# EAGLE design 1608_lora_communicator (EAGLE 9.6.2)
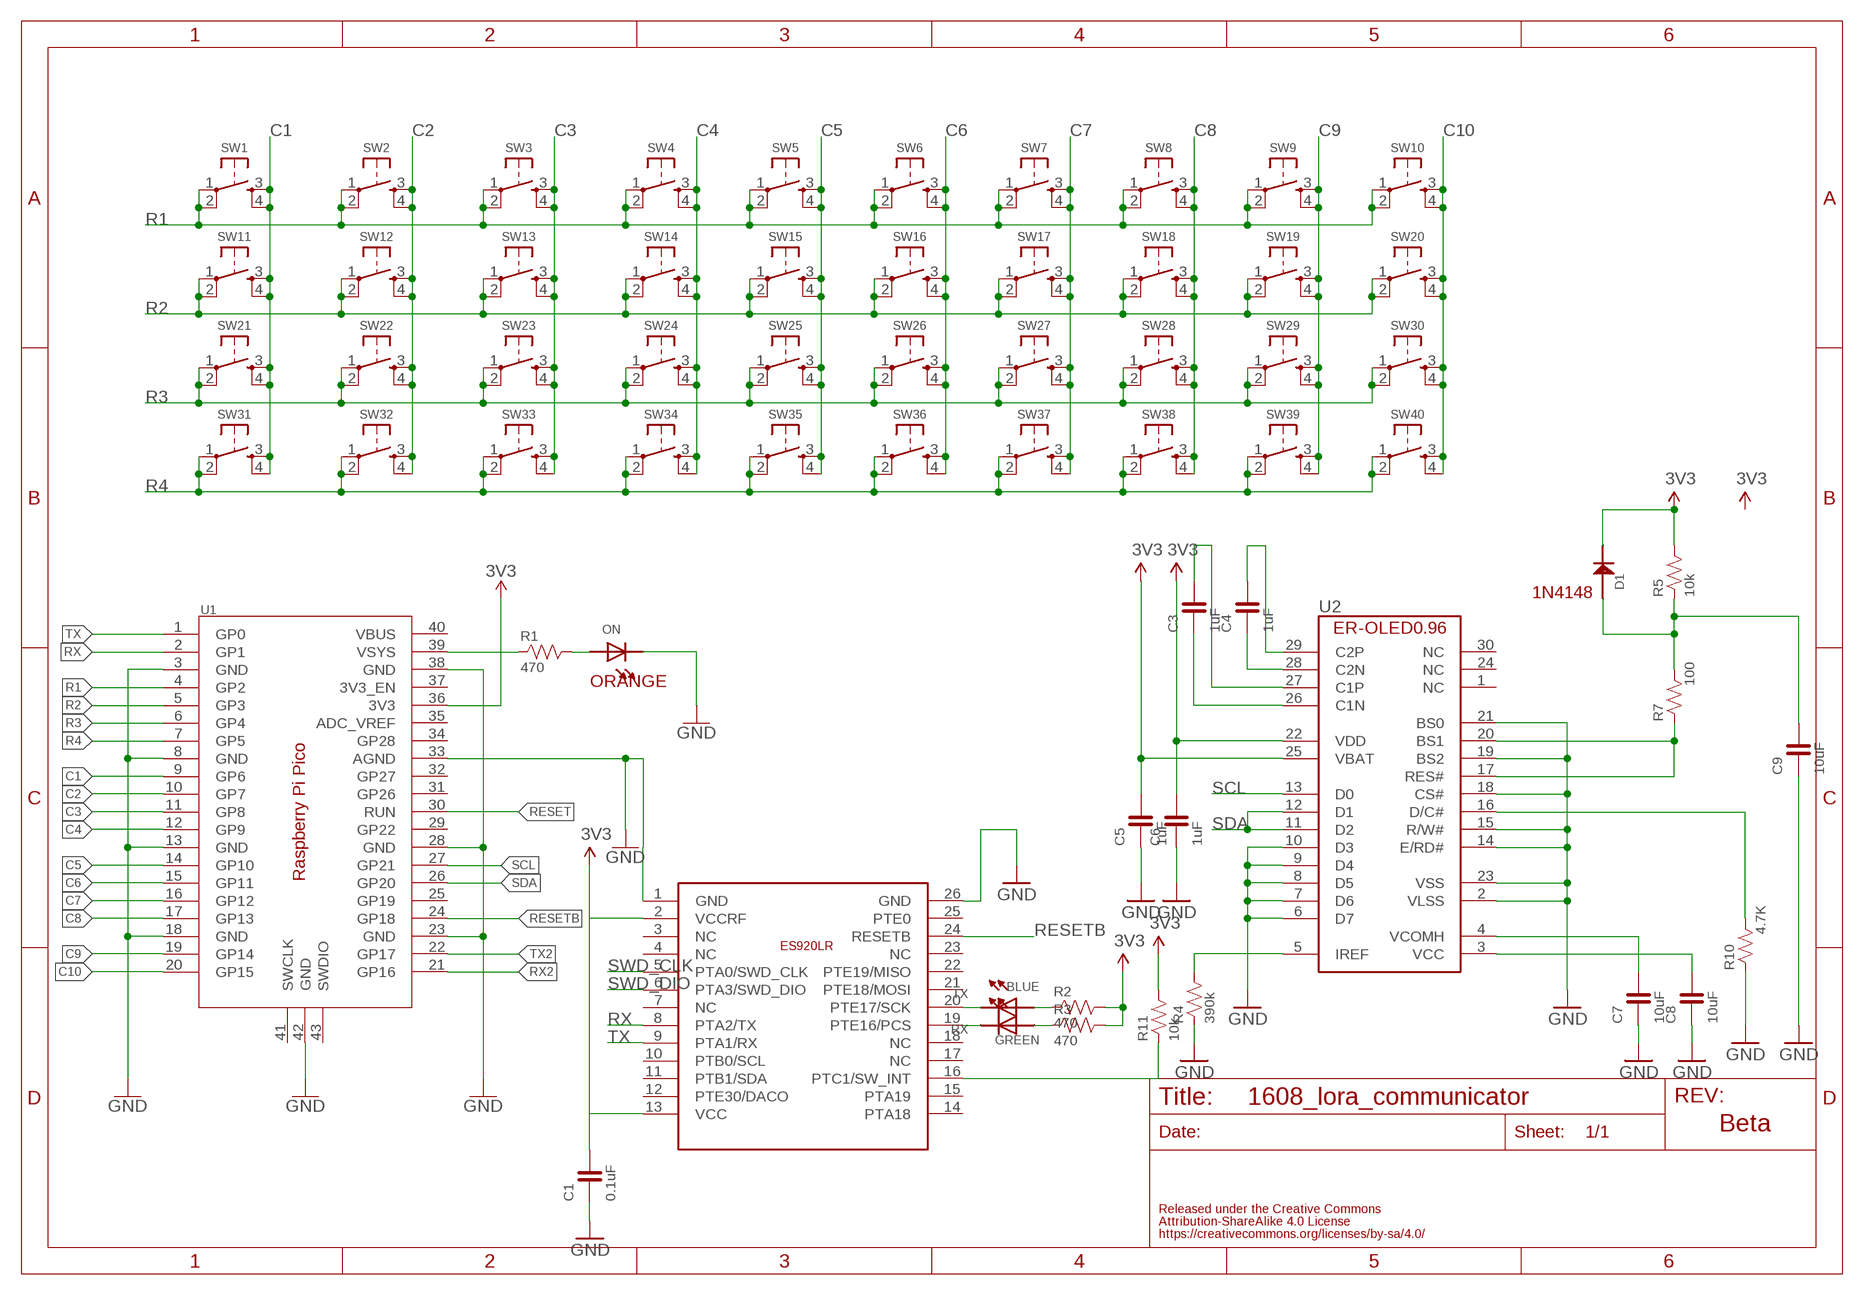
[diagram p0: schematic, sheet 1]

## Parts
C1  0.1uF  CAPACITOR-0603_NARROW  [0603-NARROW]
C3  1uF  CAPACITOR-0603  [0603]
C4  1uF  CAPACITOR-0603  [0603]
C5  1uF  CAPACITOR-0603  [0603]
C6  1uF  CAPACITOR-0603  [0603]
C7  10uF  CAPACITOR-0603  [0603]
C8  10uF  CAPACITOR-0603  [0603]
C9  10uF  CAPACITOR-0603  [0603]
D1  1N4148  [1N4148W]
ON  LED-0603  [0603]
R1  470  RESISTOR-0603  [0603]
R2  470  RESISTOR-0603  [0603]
R3  470  RESISTOR-0603  [0603]
R4  390k  RESISTOR-0603  [0603]
R5  10k  RESISTOR-0603  [0603]
R7  100  RESISTOR-0603  [0603]
R10  4.7K  RESISTOR-0603  [0603]
R11  10k  RESISTOR-0603-NARROW  [0603-NARROW]
RX  GREEN  LED-0603  [0603]
SW1  TACT-SWITCH-6MM  [DTS_6_V]
SW2  TACT-SWITCH-6MM  [DTS_6_V]
SW3  TACT-SWITCH-6MM  [DTS_6_V]
SW4  TACT-SWITCH-6MM  [DTS_6_V]
SW5  TACT-SWITCH-6MM  [DTS_6_V]
SW6  TACT-SWITCH-6MM  [DTS_6_V]
SW7  TACT-SWITCH-6MM  [DTS_6_V]
SW8  TACT-SWITCH-6MM  [DTS_6_V]
SW9  TACT-SWITCH-6MM  [DTS_6_V]
SW10  TACT-SWITCH-6MM  [DTS_6_V]
SW11  TACT-SWITCH-6MM  [DTS_6_V]
SW12  TACT-SWITCH-6MM  [DTS_6_V]
SW13  TACT-SWITCH-6MM  [DTS_6_V]
SW14  TACT-SWITCH-6MM  [DTS_6_V]
SW15  TACT-SWITCH-6MM  [DTS_6_V]
SW16  TACT-SWITCH-6MM  [DTS_6_V]
SW17  TACT-SWITCH-6MM  [DTS_6_V]
SW18  TACT-SWITCH-6MM  [DTS_6_V]
SW19  TACT-SWITCH-6MM  [DTS_6_V]
SW20  TACT-SWITCH-6MM  [DTS_6_V]
SW21  TACT-SWITCH-6MM  [DTS_6_V]
SW22  TACT-SWITCH-6MM  [DTS_6_V]
SW23  TACT-SWITCH-6MM  [DTS_6_V]
SW24  TACT-SWITCH-6MM  [DTS_6_V]
SW25  TACT-SWITCH-6MM  [DTS_6_V]
SW26  TACT-SWITCH-6MM  [DTS_6_V]
SW27  TACT-SWITCH-6MM  [DTS_6_V]
SW28  TACT-SWITCH-6MM  [DTS_6_V]
SW29  TACT-SWITCH-6MM  [DTS_6_V]
SW30  TACT-SWITCH-6MM  [DTS_6_V]
SW31  TACT-SWITCH-6MM  [DTS_6_V]
SW32  TACT-SWITCH-6MM  [DTS_6_V]
SW33  TACT-SWITCH-6MM  [DTS_6_V]
SW34  TACT-SWITCH-6MM  [DTS_6_V]
SW35  TACT-SWITCH-6MM  [DTS_6_V]
SW36  TACT-SWITCH-6MM  [DTS_6_V]
SW37  TACT-SWITCH-6MM  [DTS_6_V]
SW38  TACT-SWITCH-6MM  [DTS_6_V]
SW39  TACT-SWITCH-6MM  [DTS_6_V]
SW40  TACT-SWITCH-6MM  [DTS_6_V]
TX  BLUE  LED-0603  [0603]
U1  RASPBERRY_PI_PICORASPBERRY_PI_PICO_2BY20TH  [RASPBERRY_PI_PICO_HEADER_BOTH]
U2  ER-OLED0.96-1ER-CON30HT-1  [ER-CON30HT-1]
U3  ES920LR_MODULE  [MODULE]

## Nets
3V3: C1.2 C5.2 C6.2 D1.CATHODE R2.2 R3.2 R5.2 R11.2 U1.36(3V3) U2.22(VDD) U2.25(VBAT) U3.2(VCCRF) U3.13(VCC)
C1: SW1.3 SW1.4 SW11.3 SW11.4 SW21.3 SW21.4 SW31.3 SW31.4 U1.9(GP6)
C2: SW2.3 SW2.4 SW12.3 SW12.4 SW22.3 SW22.4 SW32.3 SW32.4 U1.10(GP7)
C3: SW3.3 SW3.4 SW13.3 SW13.4 SW23.3 SW23.4 SW33.3 SW33.4 U1.11(GP8)
C4: SW4.3 SW4.4 SW14.3 SW14.4 SW24.3 SW24.4 SW34.3 SW34.4 U1.12(GP9)
C5: SW5.3 SW5.4 SW15.3 SW15.4 SW25.3 SW25.4 SW35.3 SW35.4 U1.14(GP10)
C6: SW6.3 SW6.4 SW16.3 SW16.4 SW26.3 SW26.4 SW36.3 SW36.4 U1.15(GP11)
C7: SW7.3 SW7.4 SW17.3 SW17.4 SW27.3 SW27.4 SW37.3 SW37.4 U1.16(GP12)
C8: SW8.3 SW8.4 SW18.3 SW18.4 SW28.3 SW28.4 SW38.3 SW38.4 U1.17(GP13)
C9: SW9.3 SW9.4 SW19.3 SW19.4 SW29.3 SW29.4 SW39.3 SW39.4 U1.19(GP14)
C10: SW10.3 SW10.4 SW20.3 SW20.4 SW30.3 SW30.4 SW40.3 SW40.4 U1.20(GP15)
D/C: R10.2 U2.16(D/C#)
GND: C1.1 C5.1 C6.1 C7.1 C8.1 C9.1 ON.CATHODE R4.1 R10.1 U1.3(GND) U1.8(GND) U1.13(GND) U1.18(GND) U1.23(GND) U1.28(GND) U1.33(AGND) U1.38(GND) U1.42(GND) U2.2(VLSS) U2.6(D7) U2.7(D6) U2.8(D5) U2.9(D4) U2.10(D3) U2.14(E/RD#) U2.15(R/W#) U2.18(CS#) U2.19(BS2) U2.21(BS0) U2.23(VSS) U3.1(GND)
N$1: R1.1 U1.39(VSYS)
N$2: ON.ANODE R1.2 U3.26(GND) ; supply symbol labelled GND
N$3: C3.2 U2.27(C1P)
N$4: C3.1 U2.26(C1N)
N$5: C4.1 U2.28(C2N)
N$6: C4.2 U2.29(C2P)
N$7: R4.2 U2.5(IREF)
N$8: C7.2 U2.4(VCOMH)
N$9: C8.2 U2.3(VCC)
N$10: R7.1 U2.17(RES#) U2.20(BS1)
N$11: RX.CATHODE U3.19(PTE16/PCS)
N$12: C9.2 D1.ANODE R5.1 R7.2
N$13: TX.CATHODE U3.20(PTE17/SCK)
N$16: R2.1 TX.ANODE
N$17: R3.1 RX.ANODE
N$18: R11.1 U3.16(PTC1/SW_INT)
R1: SW1.1 SW1.2 SW2.1 SW2.2 SW3.1 SW3.2 SW4.1 SW4.2 SW5.1 SW5.2 SW6.1 SW6.2 SW7.1 SW7.2 SW8.1 SW8.2 SW9.1 SW9.2 SW10.1 SW10.2 U1.4(GP2)
R2: SW11.1 SW11.2 SW12.1 SW12.2 SW13.1 SW13.2 SW14.1 SW14.2 SW15.1 SW15.2 SW16.1 SW16.2 SW17.1 SW17.2 SW18.1 SW18.2 SW19.1 SW19.2 SW20.1 SW20.2 U1.5(GP3)
R3: SW21.1 SW21.2 SW22.1 SW22.2 SW23.1 SW23.2 SW24.1 SW24.2 SW25.1 SW25.2 SW26.1 SW26.2 SW27.1 SW27.2 SW28.1 SW28.2 SW29.1 SW29.2 SW30.1 SW30.2 U1.6(GP4)
R4: SW31.1 SW31.2 SW32.1 SW32.2 SW33.1 SW33.2 SW34.1 SW34.2 SW35.1 SW35.2 SW36.1 SW36.2 SW37.1 SW37.2 SW38.1 SW38.2 SW39.1 SW39.2 SW40.1 SW40.2 U1.7(GP5)
RESET: U1.30(RUN)
RESETB: U1.24(GP18) U3.24(RESETB)
RX: U1.2(GP1) U3.8(PTA2/TX)
RX2: U1.21(GP16)
SCL: U1.27(GP21) U2.13(D0)
SDA: U1.26(GP20) U2.11(D2) U2.12(D1)
SWD_CLK: U3.5(PTA0/SWD_CLK)
SWD_DIO: U3.6(PTA3/SWD_DIO)
TX: U1.1(GP0) U3.9(PTA1/RX)
TX2: U1.22(GP17)
Unconnected: U1.25(GP19) U1.29(GP22) U1.31(GP26) U1.32(GP27) U1.34(GP28) U1.35(ADC_VREF) U1.37(3V3_EN) U1.40(VBUS) U1.41(SWCLK) U1.43(SWDIO) U2.1(NC) U2.24(NC) U2.30(NC) U3.3(NC) U3.4(NC) U3.7(NC) U3.10(PTB0/SCL) U3.11(PTB1/SDA) U3.12(PTE30/DACO) U3.14(PTA18) U3.15(PTA19) U3.17(NC) U3.18(NC) U3.21(PTE18/MOSI) U3.22(PTE19/MISO) U3.23(NC) U3.25(PTE0)

## Notes on the sheet
- 1N4148
- ORANGE
- Beta

## Library data of the parts
C1 C3-C9 = FaBo-Capacitor:CAPACITOR: CAPACITOR
D1 = FaBo-Diode:1N4148
ON RX TX = FaBo-LED:LED
R1-R5 R7 R10 R11 = FaBo-Resistors:RESISTOR: RESISTOR
SW1-SW40 = FaBo-Switch:TACT-SWITCH: Part No Maker Datasheet Distributor 1273HA-160G-G SWITRONIC Catalog <http://www.switronic.com/uploads/images/A10.gif> Akizuki <http://akizukidenshi.com/catalog/g/gP-02561/> DTS-6-V Cosland DTS 6 Series <http://www.cosland.com/newproduct/DTS%20SERIES.pdf> Akizuki <http://akizukidenshi.com/catalog/g/gP-03647/> KMR2 C&K KMR2 SERIES <https://www.ckswitches.com/products/switches/product-details/Tactile/KMR2/> Octoparts Result <https://octopart.com/search?q=KMR2&start=0> TSHA-T-XB2-19E TOP UP INDUSTORY TSHA-T <http://www.top-up.com.tw/front/bin/ptdetail.phtml?Part=TSHA-T> Akizuki <http://akizukidenshi.com/catalog/g/gP-09361/>
U1 = FaBo-Boards:RASPBERRY_PI_PICO
U2 = FaBo-Display:ER-OLED0.96-1
U3 = FaBo-LoRa:ES920LR_MODULE

## Board
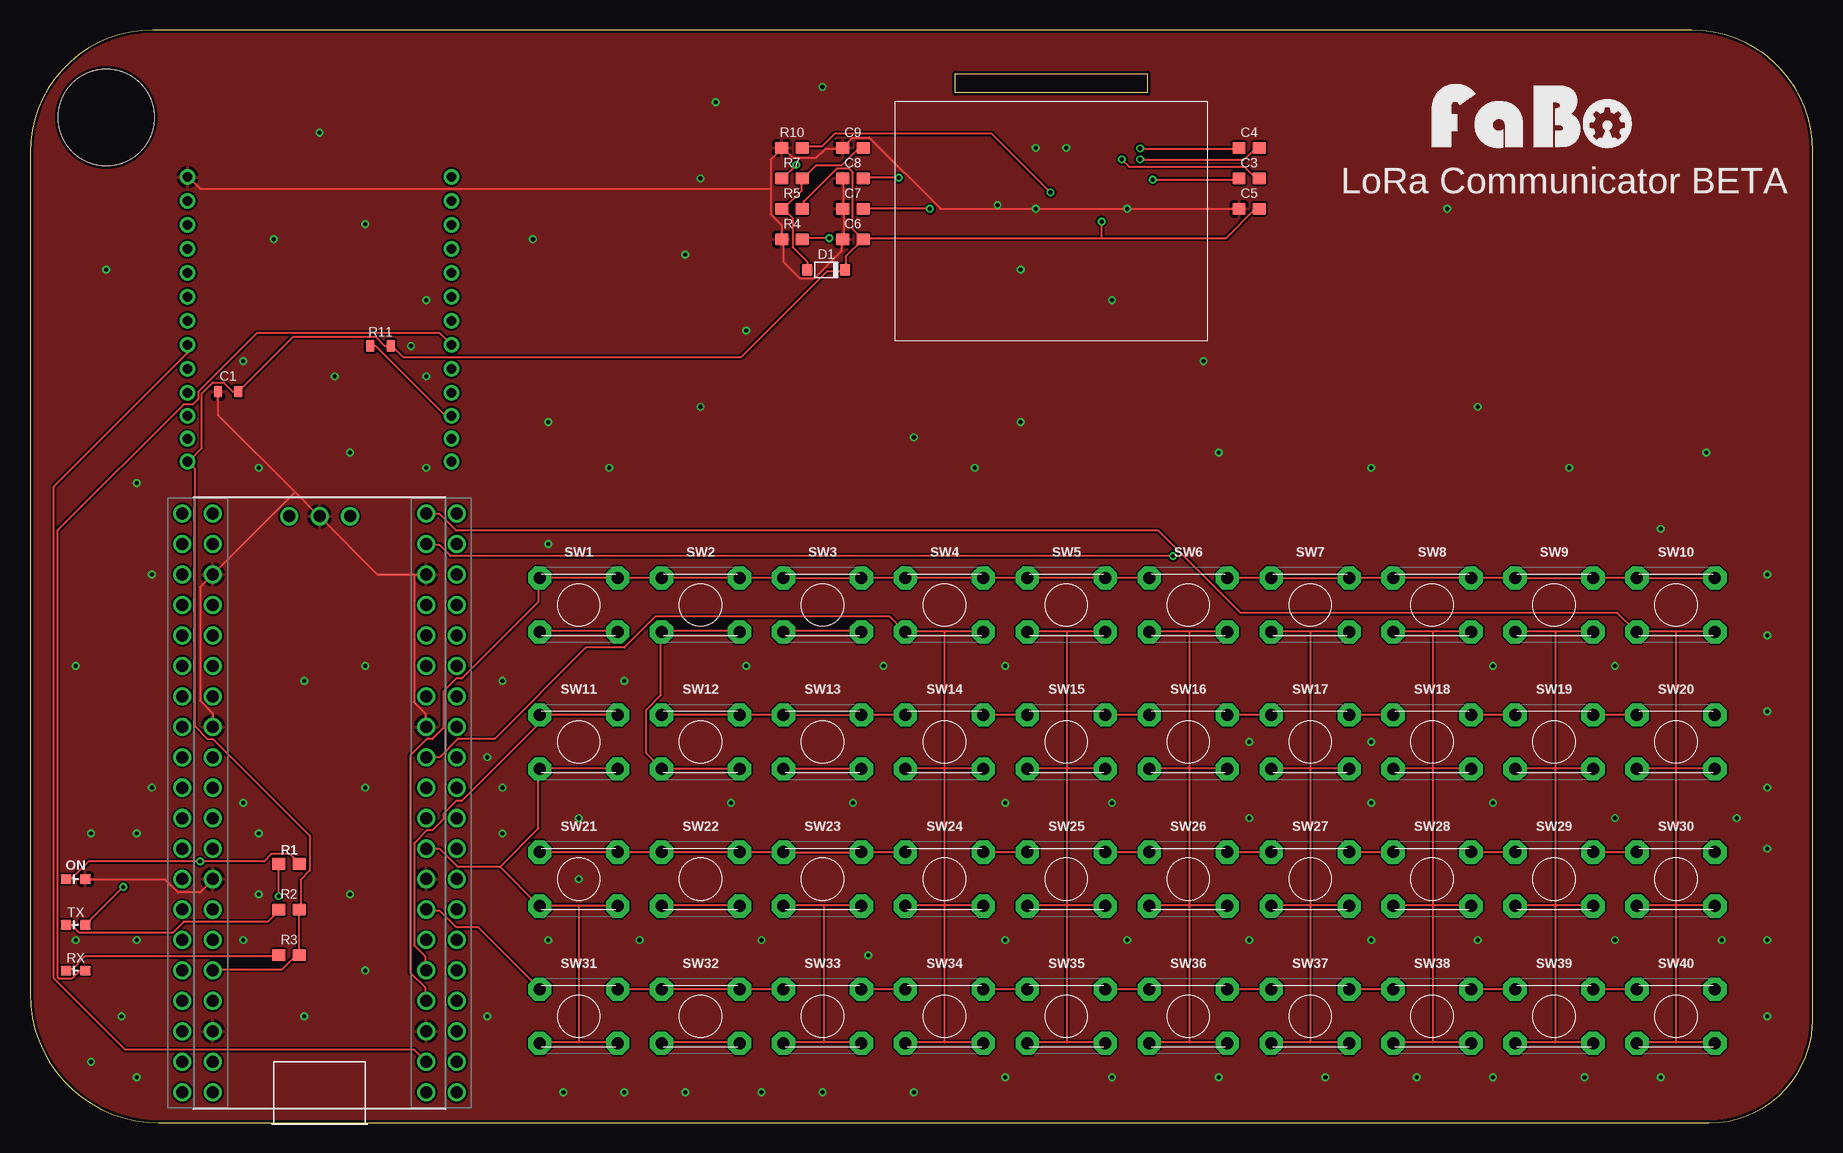
[diagram p1: board, top side]
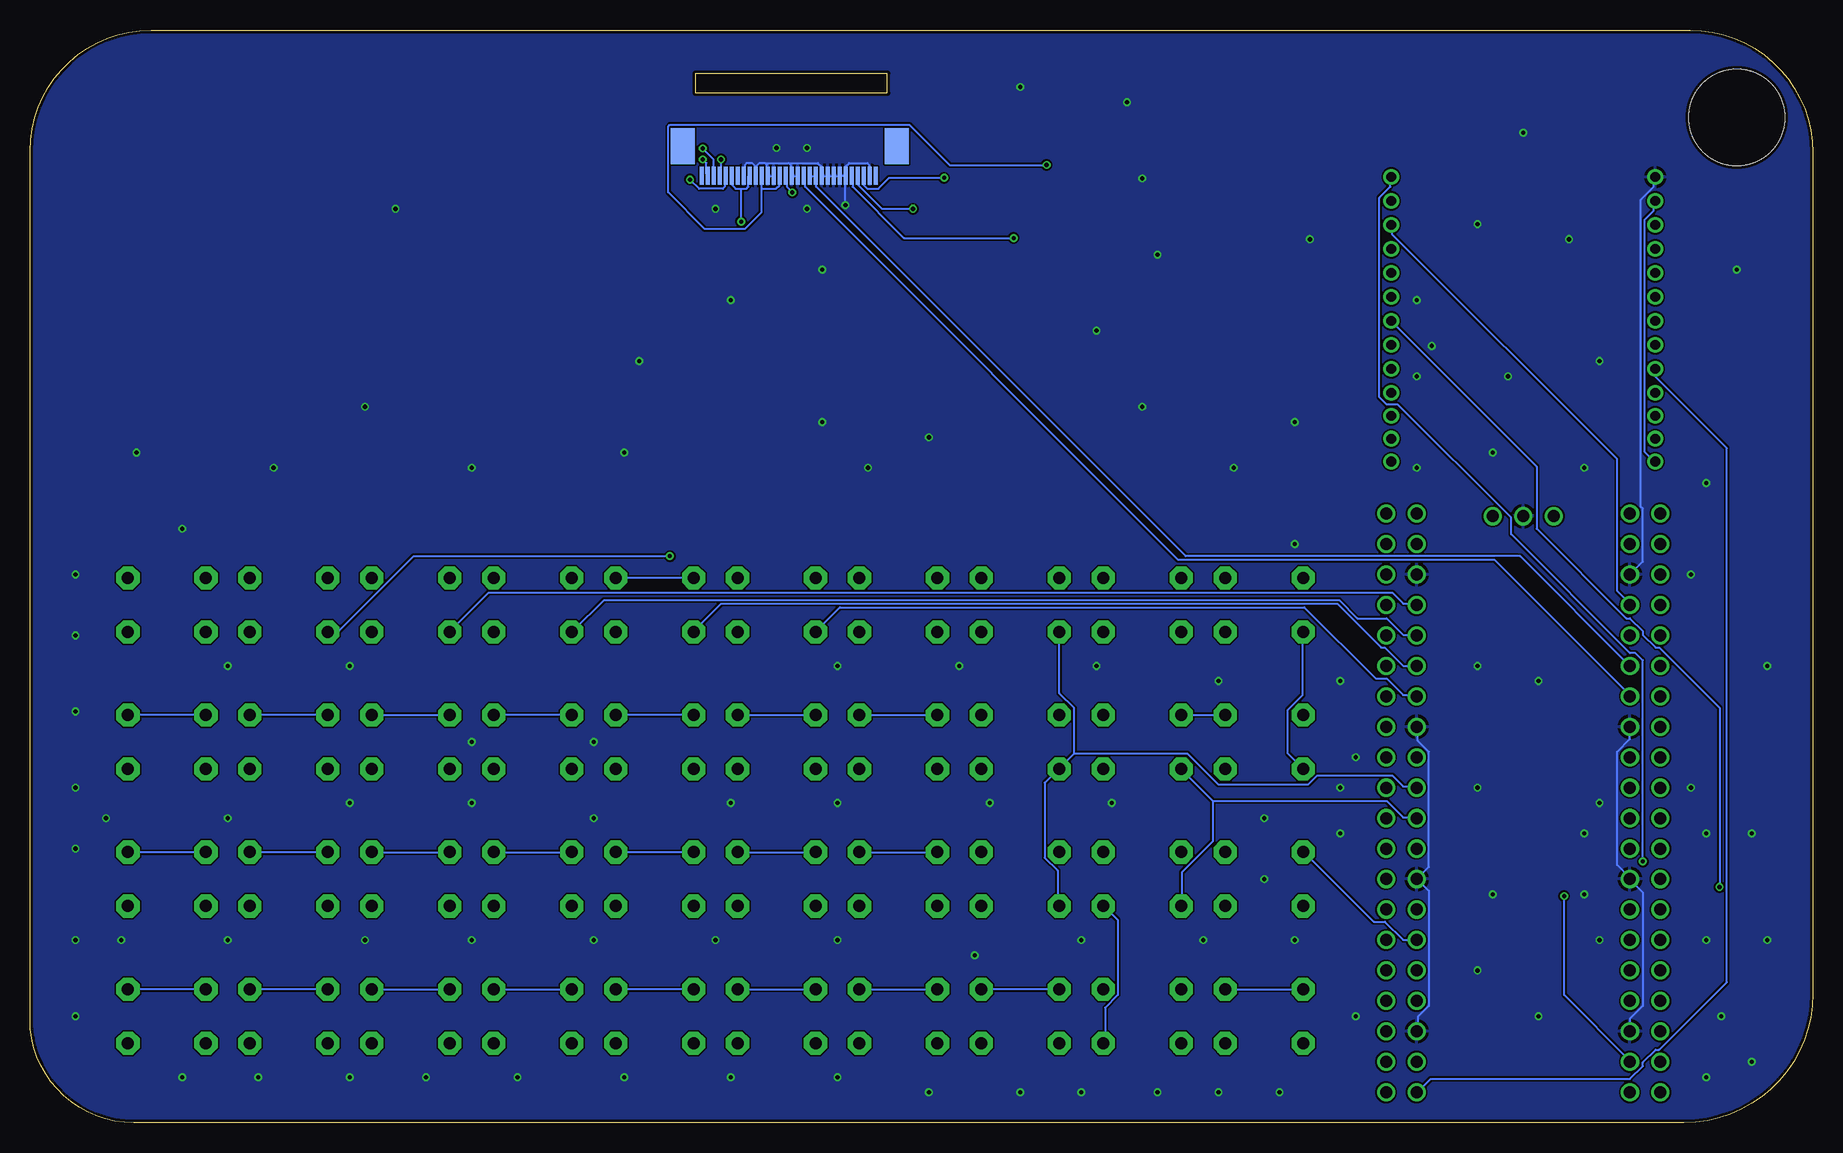
[diagram p2: board, bottom side, seen from below]

Size 148.57 x 91.11 mm. Coordinates in mm from the lower left corner, seen from the top.
Outline: 0,80.89 0,10.75 arc90 10.75,0 139.93,0 arc90 148.57,8.64 148.57,81.02 arc90 138.48,91.11 10.22,91.11 arc90 0,80.89
Outline: 77.12,87.47 93.12,87.47 93.12,85.86 77.12,85.86 77.12,87.47
Copper layers (1*16): Top 0.035mm / dielectric 1.5mm / Bottom 0.035mm
Design rules "SeeedStudio_2layer_DRU_no_angle_20140221": minimum track width 6mil, minimum drill 12mil, track to track 6mil, track to pad 6mil, pad to pad 6mil, via to via 6mil, smd to smd 0mil, copper to edge 10mil, drill to drill 10mil, minimum pad ring 10mil, minimum via ring 6mil, stop-mask expansion 2mil, vias tented up to drill 100mil, thermal gap 10mil
Holes 8 mm at 6.35,83.82

### Footprints (pad centres in the part's own frame; a part is rotated, then mirrored left to right if it is on the bottom)
0603-NARROW = smd 0.71 x 1: 1 -0.85,0; 2 0.85,0
0603 = smd 1.1 x 1: 1 -0.85,0; 2 0.85,0
1N4148W = smd 0.9 x 0.95: ANODE 0,0; CATHODE 3.15,0
0603' = smd 0.9 x 0.8: ANODE -0.8,0; CATHODE 0.8,0
DTS_6_V = drill 1 pad 1.93 octagon: 1 -3.25,2.25; 2 3.25,2.25; 3 -3.25,-2.25; 4 3.25,-2.25
RASPBERRY_PI_PICO_HEADER_BOTH = drill 1: 1 -8.89,24.13; 2 -8.89,21.59; 3 -8.89,19.05; 4 -8.89,16.51; 5 -8.89,13.97; 6 -8.89,11.43; 7 -8.89,8.89; 8 -8.89,6.35; 9 -8.89,3.81; 10 -8.89,1.27; 11 -8.89,-1.27; 12 -8.89,-3.81; 13 -8.89,-6.35; 14 -8.89,-8.89; 15 -8.89,-11.43; 16 -8.89,-13.97; 17 -8.89,-16.51; 18 -8.89,-19.05; 19 -8.89,-21.59; 20 -8.89,-24.13; 21 8.89,-24.13; 22 8.89,-21.59; 23 8.89,-19.05; 24 8.89,-16.51; 25 8.89,-13.97; 26 8.89,-11.43; 27 8.89,-8.89; 28 8.89,-6.35; 29 8.89,-3.81; 30 8.89,-1.27; 31 8.89,1.27; 32 8.89,3.81; 33 8.89,6.35; 34 8.89,8.89; 35 8.89,11.43; 36 8.89,13.97; 37 8.89,16.51; 38 8.89,19.05; 39 8.89,21.59; 40 8.89,24.13; 41 -2.54,-23.9; 42 0,-23.9; 43 2.54,-23.9; 44 -11.43,24.13; 45 -11.43,21.59; 46 -11.43,19.05; 47 -11.43,16.51; 48 -11.43,13.97; 49 -11.43,11.43; 50 -11.43,8.89; 51 -11.43,6.35; 52 -11.43,3.81; 53 -11.43,1.27; 54 -11.43,-1.27; 55 -11.43,-3.81; 56 -11.43,-6.35; 57 -11.43,-8.89; 58 -11.43,-11.43; 59 -11.43,-13.97; 60 -11.43,-16.51; 61 -11.43,-19.05; 62 -11.43,-21.59; 63 -11.43,-24.13; 64 11.43,24.13; 65 11.43,21.59; 66 11.43,19.05; 67 11.43,16.51; 68 11.43,13.97; 69 11.43,11.43; 70 11.43,8.89; 71 11.43,6.35; 72 11.43,3.81; 73 11.43,1.27; 74 11.43,-1.27; 75 11.43,-3.81; 76 11.43,-6.35; 77 11.43,-8.89; 78 11.43,-11.43; 79 11.43,-13.97; 80 11.43,-16.51; 81 11.43,-19.05; 82 11.43,-21.59; 83 11.43,-24.13
ER-CON30HT-1 = smd 0.3 x 1.5 bottom: 1 7,-0.23; 2 6.5,-0.23; 3 6,-0.23; 4 5.5,-0.23; 5 5,-0.23; 6 4.5,-0.23; 7 4,-0.23; 8 3.5,-0.23; 9 3,-0.23; 10 2.5,-0.23; 11 2,-0.23; 12 1.5,-0.23; 13 1,-0.23; 14 0.5,-0.23; 15 0,-0.23; 16 -0.5,-0.23; 17 -1,-0.23; 18 -1.5,-0.23; 19 -2,-0.23; 20 -2.5,-0.23; 21 -3,-0.23; 22 -3.5,-0.23; 23 -4,-0.23; 24 -4.5,-0.23; 25 -5,-0.23; 26 -5.5,-0.23; 27 -6,-0.23; 28 -6.5,-0.23; 29 -7,-0.23; 30 -7.5,-0.23 | smd 2 x 3 bottom: 31 -9.07,-2.67; 32 8.74,-2.67
MODULE = drill 0.8 pad 1.27: 1 -11,9; 2 -11,7; 3 -11,5; 4 -11,3; 5 -11,1; 6 -11,-1; 7 -11,-3; 8 -11,-5; 9 -11,-7; 10 -11,-9; 11 -11,-10.905; 12 -11,-12.81; 13 -11,-14.715; 14 11,-14.715; 15 11,-12.81; 16 11,-10.905; 17 11,-9; 18 11,-7; 19 11,-5; 20 11,-3; 21 11,-1; 22 11,1; 23 11,3; 24 11,5; 25 11,7; 26 11,9

### Placement (x,y rotation side)
C1  16.51,60.96 0 top
C3  101.6,78.74 0 top
C4  101.6,81.28 0 top
C5  101.6,76.2 0 top
C6  68.58,73.66 0 top
C7  68.58,76.2 0 top
C8  68.58,78.74 0 top
C9  68.58,81.28 0 top
D1  64.77,71.12 0 top
ON  [0603']  3.81,20.32 0 top
R1  21.59,21.59 0 top
R2  21.59,17.78 0 top
R3  21.59,13.97 0 top
R4  63.5,73.66 0 top
R5  63.5,76.2 0 top
R7  63.5,78.74 0 top
R10  63.5,81.28 0 top
R11  29.21,64.77 0 top
RX  GREEN  [0603']  3.81,12.7 0 top
SW1  45.72,43.18 0 top
SW2  55.88,43.18 0 top
SW3  66.04,43.18 0 top
SW4  76.2,43.18 0 top
SW5  86.36,43.18 0 top
SW6  96.52,43.18 0 top
SW7  106.68,43.18 0 top
SW8  116.84,43.18 0 top
SW9  127,43.18 0 top
SW10  137.16,43.18 0 top
SW11  45.72,31.75 0 top
SW12  55.88,31.75 0 top
SW13  66.04,31.75 0 top
SW14  76.2,31.75 0 top
SW15  86.36,31.75 0 top
SW16  96.52,31.75 0 top
SW17  106.68,31.75 0 top
SW18  116.84,31.75 0 top
SW19  127,31.75 0 top
SW20  137.16,31.75 0 top
SW21  45.72,20.32 0 top
SW22  55.88,20.32 0 top
SW23  66.04,20.32 0 top
SW24  76.2,20.32 0 top
SW25  86.36,20.32 0 top
SW26  96.52,20.32 0 top
SW27  106.68,20.32 0 top
SW28  116.84,20.32 0 top
SW29  127,20.32 0 top
SW30  137.16,20.32 0 top
SW31  45.72,8.89 0 top
SW32  55.88,8.89 0 top
SW33  66.04,8.89 0 top
SW34  76.2,8.89 0 top
SW35  86.36,8.89 0 top
SW36  96.52,8.89 0 top
SW37  106.68,8.89 0 top
SW38  116.84,8.89 0 top
SW39  127,8.89 0 top
SW40  137.16,8.89 0 top
TX  BLUE  [0603']  3.81,16.51 0 top
U1  24.13,26.67 180 top
U2  85.09,78.74 180 top
U3  24.13,69.85 0 top
U$2  [LOGO_FABO_L]  124.46,81.28 0 top

### Tracks (layer width: path | path; a pad name or v marks a point on that pad's centre or on a via)
3V3  (via drill 0.35)
  Top 0.152: C6.2 69.34,73.61 67.97,72.24 67.97,71.17 D1.CATHODE 67.82,71.02 66.45,71.02 59.28,63.86 31.09,63.86 30.18,64.77 R11.2 29.57,64.77 28.8,65.53 21.95,65.53 17.37,60.96 C1.2 16.92,60.96 16.15,61.72 15.24,61.72 14.33,60.81 14.33,56.24 13.26,55.17 U3.13 13.26,55.02 13.72,54.56 13.72,33.07 14.78,32 15.24,32 23.32,23.93 23.32,21.03 22.55,20.27 22.55,17.83 R2.2 22.4,17.68 22.4,14.02 R3.2 22.4,13.87 22.1,13.87 21.03,12.8 15.24,12.8 U1.36 | R5.2 64.47,76.2 64.47,76.81 67.21,79.55 68.28,79.55 68.58,79.25 68.58,74.52 69.34,73.76 C6.2 | C5.2 102.11,76.2 99.67,73.76 89.31,73.76 | 89.31,73.76 69.49,73.76 C6.2 | 89.31,73.76 v89.31,75.13
  Bottom 0.152: 89.31,77.88 89.76,77.88 90.07,78.18 90.07,78.94 U2.25 | 89.31,77.88 88.85,77.88 88.7,78.03 88.7,78.94 U2.22 | v89.31,75.13 89.31,77.88 | U3.2 13.26,76.81 13.26,76.05 14.02,75.29 14.02,55.93 13.26,55.17 U3.13
C1
  Top 0.152: SW1.3 42.52,41 48.92,41 SW1.4 | SW11.4 48.92,29.57 42.52,29.57 SW11.3 42.37,29.41 42.37,24.54 39.17,21.34 | 45.72,6.71 48.92,6.71 SW31.4 | 45.72,6.71 42.52,6.71 SW31.3 | U1.9 34.14,22.86 35.66,21.34 39.17,21.34 | 39.17,21.34 42.37,18.14 SW21.3 42.52,18.14 45.72,18.14 | 45.72,18.14 48.92,18.14 SW21.4 | 45.72,18.14 45.72,6.71
  Bottom 0.152: SW1.3 42.52,40.84 42.52,35.66 43.74,34.44 43.74,30.79 42.52,29.57 SW11.3
C2
  Top 0.152: SW32.3 52.73,6.71 58.98,6.71 SW32.4 | SW22.3 52.73,18.14 58.98,18.14 SW22.4 | SW2.4 58.98,41 52.73,41 SW2.3 52.58,40.84 52.58,35.66 51.36,34.44 51.36,30.79 52.58,29.57 SW12.3 52.73,29.57 58.98,29.57 SW12.4
  Bottom 0.152: SW32.4 58.98,6.71 58.98,9.6 57.91,10.67 57.91,16.92 58.98,17.98 SW22.4 | 49.99,26.82 35.51,26.82 34.14,25.45 33.07,25.45 U1.10 | 49.99,26.82 52.58,29.41 SW12.3 | 49.99,26.82 49.99,23.47 52.58,20.88 52.58,18.14 SW22.3
C3
  Top 0.152: 66.14,6.71 69.19,6.71 SW33.4 | 66.14,6.71 62.94,6.71 SW33.3 | 66.14,18.14 69.19,18.14 SW23.4 | 66.14,18.14 62.94,18.14 SW23.3 | 66.14,18.14 66.14,6.71 | SW3.3 62.94,41 69.19,41 SW3.4 | SW13.4 69.19,29.57 62.94,29.57 SW13.3
  Bottom 0.152: 61.57,30.79 52.12,30.79 49.53,28.19 42.06,28.19 41.3,28.96 35.05,28.96 34.14,28.04 33.07,28.04 U1.11 | 61.57,30.79 62.79,29.57 SW13.3 62.94,29.41 64.01,28.35 64.01,22.1 62.94,21.03 62.94,18.14 SW23.3 | 61.57,30.79 61.57,34.59 62.79,35.81 62.79,40.84 SW3.3
C4
  Top 0.152: 76.2,6.71 79.4,6.71 SW34.4 | 76.2,6.71 73,6.71 SW34.3 | 76.2,18.14 79.4,18.14 SW24.4 | 76.2,18.14 73,18.14 SW24.3 | 76.2,18.14 76.2,6.71 | 76.2,29.57 79.4,29.57 SW14.4 | 76.2,29.57 73,29.57 SW14.3 | U1.12 34.14,30.48 35.66,32 38.71,32 46.33,39.62 49.53,39.62 52.12,42.22 71.63,42.22 72.85,41 SW4.3 73,41 76.2,41 | 76.2,41 79.4,41 SW4.4 | 76.2,41 76.2,29.57 | 76.2,29.57 76.2,18.14
C5
  Top 0.152: 86.41,6.71 89.46,6.71 SW35.4 | 86.41,6.71 83.21,6.71 SW35.3 | 86.41,18.14 89.46,18.14 SW25.4 | 86.41,18.14 83.21,18.14 SW25.3 | 86.41,18.14 86.41,6.71 | 86.41,29.57 89.46,29.57 SW15.4 | 86.41,29.57 83.21,29.57 SW15.3 | 86.41,41 83.21,41 SW5.3 | 86.41,41 89.46,41 SW5.4 | 86.41,41 86.41,29.57 | 86.41,29.57 86.41,18.14
  Bottom 0.152: U1.14 33.07,35.66 34.14,35.66 35.51,37.03 36.42,37.03 42.37,42.98 81.08,42.98 83.06,41 SW5.3
C6
  Top 0.152: 96.62,6.71 99.67,6.71 SW36.4 | 96.62,6.71 93.42,6.71 SW36.3 | 96.62,18.14 99.67,18.14 SW26.4 | 96.62,18.14 93.42,18.14 SW26.3 | 96.62,18.14 96.62,6.71 | 96.62,29.57 99.67,29.57 SW16.4 | 96.62,29.57 93.42,29.57 SW16.3 | 96.62,41 93.42,41 SW6.3 | 96.62,41 99.67,41 SW6.4 | 96.62,41 96.62,29.57 | 96.62,29.57 96.62,18.14
  Bottom 0.152: U1.15 34.14,38.1 35.66,39.62 35.97,39.62 39.62,43.28 90.98,43.28 93.27,41 SW6.3
C7
  Top 0.152: 106.68,6.71 109.88,6.71 SW37.4 | 106.68,6.71 103.48,6.71 SW37.3 | 106.68,18.14 109.88,18.14 SW27.4 | 106.68,18.14 103.48,18.14 SW27.3 | 106.68,18.14 106.68,6.71 | 106.68,29.57 109.88,29.57 SW17.4 | 106.68,29.57 103.48,29.57 SW17.3 | 106.68,41 103.48,41 SW7.3 | 106.68,41 109.88,41 SW7.4 | 106.68,41 106.68,29.57 | 106.68,29.57 106.68,18.14
  Bottom 0.152: U1.16 33.07,40.69 34.14,40.69 35.51,42.06 37.95,42.06 39.47,43.59 100.74,43.59 103.33,41 SW7.3
C8
  Top 0.152: 116.89,6.71 119.94,6.71 SW38.4 | 116.89,6.71 113.69,6.71 SW38.3 | 116.89,18.14 119.94,18.14 SW28.4 | 116.89,18.14 113.69,18.14 SW28.3 | 116.89,18.14 116.89,6.71 | 116.89,29.57 119.94,29.57 SW18.4 | 116.89,29.57 113.69,29.57 SW18.3 | 116.89,41 113.69,41 SW8.3 | 116.89,41 119.94,41 SW8.4 | 116.89,41 116.89,29.57 | 116.89,29.57 116.89,18.14
  Bottom 0.152: U1.17 33.07,43.28 34.14,43.28 35.05,44.2 110.34,44.2 113.54,41 SW8.3
C9  (via drill 0.35)
  Top 0.152: 127.1,6.71 130.15,6.71 SW39.4 | 127.1,6.71 123.9,6.71 SW39.3 | 127.1,18.14 130.15,18.14 SW29.4 | 127.1,18.14 123.9,18.14 SW29.3 | 127.1,18.14 127.1,6.71 | 127.1,29.57 130.15,29.57 SW19.4 | 127.1,29.57 123.9,29.57 SW19.3 | v95.25,47.24 35.05,47.24 34.14,48.16 33.07,48.16 U1.19 | 127.1,41 123.9,41 SW9.3 | 127.1,41 130.15,41 SW9.4 | 127.1,41 127.1,29.57 | 127.1,29.57 127.1,18.14
  Bottom 0.152: v95.25,47.24 116.59,47.24 122.83,41 123.75,41 SW9.3
C10
  Top 0.152: 137.16,6.71 140.36,6.71 SW40.4 | 137.16,6.71 133.96,6.71 SW40.3 | 137.16,18.14 140.36,18.14 SW30.4 | 137.16,18.14 133.96,18.14 SW30.3 | 137.16,18.14 137.16,6.71 | 137.16,29.57 140.36,29.57 SW20.4 | 137.16,29.57 133.96,29.57 SW20.3 | U1.20 33.07,50.75 34.14,50.75 35.51,49.38 94.03,49.38 100.89,42.52 132.28,42.52 133.81,41 SW10.3 133.96,41 137.16,41 | 137.16,41 140.36,41 SW10.4 | 137.16,41 137.16,29.57 | 137.16,29.57 137.16,18.14
D/C  (via drill 0.35)
  Top 0.152: v85.04,77.57 80.16,82.45 67.06,82.45 65.99,81.38 64.47,81.38 R10.2
  Bottom 0.152: v85.04,77.57 85.5,78.03 85.5,78.94 U2.16
GND  (via drill 0.35)
  Top 0.152: 22.1,52.58 24.08,50.6 U1.42 24.23,50.44 28.96,45.72 32,45.72 | 22.1,52.58 15.7,58.98 15.7,60.96 C1.1 | 32,45.72 U1.18 | 32,45.72 32,35.05 32.92,34.14 32.92,33.07 U1.13 | 67.82,76.2 67.82,73.76 C6.1 67.67,73.61 67.67,72.69 65.38,70.41 64.16,70.41 62.79,71.78 62.79,73.61 R4.1 62.64,73.76 62.64,74.83 61.72,75.74 61.72,77.88 | 67.82,76.2 67.82,78.64 C8.1 | 67.82,76.2 C7.1 | 61.72,77.88 61.72,80.31 62.64,81.23 R10.1 62.79,81.23 63.55,80.47 65.53,80.47 66.29,81.23 67.67,81.23 C9.1 67.82,81.38 68.58,82.14 69.95,82.14 75.89,76.2 80.62,76.2 | 80.62,76.2 C5.1 | 80.62,76.2 v80.62,76.5 | ON.CATHODE 4.72,20.27 11.28,20.27 12.34,19.2 14.17,19.2 15.24,20.27 U1.33 | U1.28 15.24,34.14 14.17,35.2 14.17,44.65 U1.23 22.1,52.58 | 61.72,77.88 14.17,77.88 13.26,78.79 U3.1
  Bottom 0.152: U1.3 32.92,7.62 32.92,8.84 32,9.75 32,19.36 32.92,20.27 U1.8 32,21.34 32,30.94 32.92,31.85 32.92,32.92 U1.13 | U2.2 78.64,79.1 78.64,79.86 78.79,80.01 80.31,80.01 80.62,79.7 80.62,79.1 U2.6 80.62,78.94 | 80.62,78.94 81.08,78.94 U2.7 81.23,78.94 81.53,78.94 U2.8 81.69,78.94 81.99,78.94 U2.9 82.14,78.94 82.45,78.94 U2.10 82.6,79.1 82.6,79.7 82.91,80.01 85.34,80.01 | U2.14 84.73,78.94 85.04,78.94 U2.15 85.19,79.1 85.19,79.86 85.34,80.01 | U2.18 86.72,78.94 87.02,78.94 U2.19 87.17,79.1 87.17,79.86 87.33,80.01 | 88.09,79.7 88.09,79.1 U2.21 88.09,79.7 | 88.09,79.7 87.78,80.01 87.33,80.01 | 88.09,79.7 88.39,80.01 88.85,80.01 89,79.86 89,79.1 U2.23 | 87.33,80.01 85.34,80.01 | v80.62,76.5 80.62,78.94 | U1.38 15.24,8.69 14.17,9.75 14.17,19.2 15.24,20.27 U1.33 15.24,20.42 16.31,21.49 16.31,30.94 15.24,32 U1.28 | U1.23 14.17,46.79 14.17,51.21 14.33,51.36 14.33,76.96 13.26,78.03 13.26,78.79 U3.1
  other vias: 54.61,72.39 33.02,68.58 25.4,62.23 8.89,53.34 19.05,54.61 48.26,54.61 17.78,26.67 10.16,45.72 3.81,38.1 10.16,27.94 97.79,63.5 82.55,58.42 73.66,57.15 82.55,71.12 38.1,30.48 43.18,48.26 3.81,15.24 8.89,15.24 17.78,15.24 19.05,24.13 8.89,24.13 5.08,24.13 7.62,8.89 5.08,5.08 8.89,3.81 22.86,8.89 19.05,19.05 24.13,82.55 27.94,74.93 20.32,73.66 6.35,71.12 118.11,76.2 91.44,76.2 90.17,68.58 41.91,73.66 27.94,27.94 27.94,38.1 33.02,54.61 26.67,55.88 22.86,36.83 26.67,19.05 27.94,12.7 43.18,15.24 50.8,15.24 45.72,20.32 58.42,26.67 68.58,26.67 71.12,38.1 59.69,38.1 49.53,36.83 39.37,36.83 44.45,2.54 49.53,2.54 54.61,2.54 60.96,2.54 66.04,2.54 60.96,15.24 73.66,2.54 81.28,3.81 90.17,3.81 99.06,3.81 107.95,3.81 115.57,3.81 121.92,3.81 129.54,3.81 135.89,3.81 144.78,8.89 144.78,15.24 144.78,22.86 144.78,27.94 144.78,34.29 144.78,40.64 144.78,45.72 139.7,55.88 128.27,54.61 111.76,54.61 120.65,59.69 101.6,25.4 111.76,26.67 111.76,31.75 101.6,31.75 101.6,15.24 111.76,15.24 90.17,26.67 81.28,26.67 81.28,38.1 81.28,15.24 91.44,15.24 69.85,13.97 120.65,15.24 121.92,26.67 121.92,38.1 132.08,38.1 132.08,25.4 132.08,15.24 140.97,15.24 142.24,25.4 135.89,49.53 59.69,66.04 43.18,58.42 17.78,63.5 31.75,64.77 33.02,62.23 99.06,55.88 78.74,54.61 55.88,59.69 86.36,81.28 83.82,81.28 83.82,76.2 66.04,86.36 57.15,85.09 55.88,78.74 39.37,27.94 45.72,25.4 39.37,24.13 38.1,8.89
  pour Top: 0,0 0,91.44 11.43,91.44 148.59,91.44 148.59,0
  pour Bottom: 0,0 148.59,0 148.59,91.44 0,91.44
N$1  (via drill 0.35)
  Top 0.152: v20.73,18.9 20.73,21.49 R1.1
  Bottom 0.152: v20.73,18.9 20.73,10.67 15.24,5.18 U1.39
N$2  (via drill 0.35)
  Top 0.152: ON.ANODE 3.05,20.42 3.5,20.42 4.88,21.79 v14.17,21.79 19.51,21.79 20.12,22.4 21.64,22.4 22.4,21.64 R1.2
  Bottom 0.152: v14.17,21.79 14.17,38.56 14.78,39.17 15.24,39.17 25.15,49.07 25.15,50.44 34.59,59.89 35.51,59.89 36.12,60.5 36.12,77.11 35.2,78.03 35.2,78.79 U3.26
N$3  (via drill 0.35)
  Top 0.152: v90.98,80.31 91.59,79.7 101.19,79.7 102.11,78.79 102.41,78.79 C3.2
  Bottom 0.152: v90.98,80.31 90.98,79.1 U2.27
N$4  (via drill 0.35)
  Top 0.152: v93.57,78.64 100.74,78.64 C3.1
  Bottom 0.152: v93.57,78.64 92.81,77.88 90.83,77.88 90.68,78.03 90.68,78.94 U2.26
N$5  (via drill 0.35)
  Top 0.152: v92.51,81.23 100.74,81.23 C4.1
  Bottom 0.152: v92.51,81.23 91.59,80.31 91.59,79.1 U2.28
N$6  (via drill 0.35)
  Top 0.152: v92.51,80.31 101.19,80.31 102.11,81.23 102.41,81.23 C4.2
  Bottom 0.152: v92.51,80.31 92.2,80.01 92.2,79.1 U2.29
N$7  (via drill 0.35)
  Top 0.152: v66.6,73.76 64.47,73.76 R4.2
  Bottom 0.152: v66.6,73.76 75.74,73.76 80.01,78.03 80.01,78.94 U2.5
N$8  (via drill 0.35)
  Top 0.152: v74.98,76.2 C7.2
  Bottom 0.152: v74.98,76.2 77.57,76.2 79.55,78.18 79.55,78.94 U2.4
N$9  (via drill 0.35)
  Top 0.152: v72.39,78.79 69.49,78.79 C8.2
  Bottom 0.152: v72.39,78.79 76.96,78.79 77.88,77.88 78.79,77.88 79.1,78.18 79.1,78.94 U2.3
N$10  (via drill 0.35)
  Top 0.152: v63.86,79.86 62.79,78.79 R7.1
  Bottom 0.152: v63.86,79.86 71.93,79.86 75.29,83.21 95.25,83.21 95.4,83.06 95.4,77.57 92.35,74.52 89,74.52 87.63,75.89 87.63,77.88 | 87.63,77.88 87.63,78.94 U2.20 | 87.63,77.88 86.41,77.88 86.11,78.18 86.11,78.94 U2.17
N$11
  Top 0.152: RX.CATHODE 4.57,12.65 4.12,12.65 3.5,12.04 2.44,12.04 2.29,12.19 2.29,49.38 12.8,59.89 13.56,59.89 14.02,60.35 14.02,60.96 18.9,65.84 34.14,65.84 35.05,64.92 U3.19
N$12
  Top 0.152: D1.ANODE 64.77,71.78 63.55,73 63.55,75.44 62.79,76.2 | 62.79,76.2 64.31,77.72 64.31,78.64 R7.2 64.47,78.79 65.53,79.86 67.67,79.86 69.04,81.23 69.34,81.23 C9.2 | 62.79,76.2 R5.1
N$13  (via drill 0.35)
  Top 0.152: v7.77,19.66 4.72,16.61 TX.CATHODE
  Bottom 0.152: v7.77,19.66 7.77,34.59 12.8,39.62 13.11,39.62 14.17,40.69 14.17,41 15.24,42.06 15.54,42.06 23.01,49.53 23.01,54.71 35.05,66.75 U3.20
N$16
  Top 0.152: TX.ANODE 3.05,16.46 3.5,16.46 4.12,15.85 11.89,15.85 12.8,16.76 19.81,16.76 20.73,17.68 R2.1
N$17
  Top 0.152: RX.ANODE 3.05,12.8 3.5,12.8 4.57,13.87 20.73,13.87 R3.1
N$18
  Top 0.152: R11.1 28.8,64.77 34.59,58.98 35.05,58.98 U3.16
R1
  Top 0.152: U1.4 32.92,10.21 32.92,11.28 31.7,12.5 31.7,30.63 33.07,32 33.53,32 34.44,32.92 34.44,35.97 35.51,37.03 35.97,37.03 42.37,43.43 42.37,45.41 SW1.1 42.52,45.41 48.92,45.41 SW1.2 49.07,45.41 52.58,45.41 SW2.1 52.73,45.41 58.98,45.41 SW2.2 59.13,45.41 62.79,45.41 SW3.1 62.94,45.41 69.19,45.41 SW3.2 69.34,45.41 72.85,45.41 SW4.1 73,45.41 79.4,45.41 SW4.2 79.55,45.41 83.06,45.41 SW5.1 83.21,45.41 89.46,45.41 SW5.2 89.61,45.41 93.27,45.41 SW6.1 | SW10.2 140.36,45.41 133.96,45.41 SW10.1 133.81,45.41 130.3,45.41 SW9.2 130.15,45.41 123.9,45.41 SW9.1 123.75,45.41 120.09,45.41 SW8.2 119.94,45.41 113.69,45.41 SW8.1 113.54,45.41 110.03,45.41 SW7.2 109.88,45.41 103.48,45.41 SW7.1 103.33,45.41 99.82,45.41 SW6.2
  Bottom 0.152: SW6.2 99.67,45.41 93.42,45.41 SW6.1
R2
  Top 0.152: SW19.2 130.3,33.98 133.81,33.98 SW20.1 | SW17.2 110.03,33.98 113.54,33.98 SW18.1 | SW18.2 120.09,33.98 123.75,33.98 SW19.1 | U1.5 32.92,12.8 32.92,13.87 32,14.78 32,23.32 33.07,24.38 33.53,24.38 34.44,25.3 34.44,25.76 35.51,26.82 35.97,26.82 42.37,33.22 42.37,33.98 SW11.1 42.52,33.98 48.92,33.98 SW11.2 | SW14.1 72.85,33.98 69.34,33.98 SW13.2 69.19,33.98 62.94,33.98 SW13.1 62.79,33.98 59.13,33.98 SW12.2 58.98,33.98 52.73,33.98 SW12.1 | SW16.2 99.82,33.98 103.33,33.98 SW17.1 | SW14.2 79.55,33.98 83.06,33.98 SW15.1 | SW15.2 89.61,33.98 93.27,33.98 SW16.1
  Bottom 0.152: SW20.2 140.36,33.98 133.96,33.98 SW20.1 | SW18.1 113.69,33.98 119.94,33.98 SW18.2 | SW19.2 130.15,33.98 123.9,33.98 SW19.1 | SW11.2 49.07,33.98 52.58,33.98 SW12.1 | SW15.1 83.21,33.98 89.46,33.98 SW15.2 | SW16.2 99.67,33.98 93.42,33.98 SW16.1 | SW14.1 73,33.98 79.4,33.98 SW14.2 | SW17.2 109.88,33.98 103.48,33.98 SW17.1
R3
  Top 0.152: SW24.1 72.85,22.55 69.34,22.55 SW23.2 69.19,22.55 62.94,22.55 SW23.1 62.79,22.55 59.13,22.55 SW22.2 58.98,22.55 52.73,22.55 SW22.1 52.58,22.55 49.07,22.55 SW21.2 48.92,22.55 42.52,22.55 SW21.1 | SW26.2 99.82,22.55 103.33,22.55 SW27.1 | SW24.2 79.55,22.55 83.06,22.55 SW25.1 | SW25.2 89.61,22.55 93.27,22.55 SW26.1 | SW29.2 130.3,22.55 133.81,22.55 SW30.1 | SW27.2 110.03,22.55 113.54,22.55 SW28.1 | SW28.2 120.09,22.55 123.75,22.55 SW29.1
  Bottom 0.152: U1.6 34.14,15.24 35.66,16.76 36.58,16.76 42.37,22.55 SW21.1 | SW25.1 83.21,22.55 89.46,22.55 SW25.2 | SW26.2 99.67,22.55 93.42,22.55 SW26.1 | SW30.2 140.36,22.55 133.96,22.55 SW30.1 | SW28.1 113.69,22.55 119.94,22.55 SW28.2 | SW29.2 130.15,22.55 123.9,22.55 SW29.1 | SW27.1 103.48,22.55 109.88,22.55 SW27.2 | SW24.1 73,22.55 79.4,22.55 SW24.2
R4
  Top 0.152: U1.7 33.07,17.68 34.14,17.68 35.51,16.31 37.34,16.31 42.37,11.28 SW31.1 | SW33.2 69.34,11.12 72.85,11.12 SW34.1 | SW31.2 49.07,11.12 52.58,11.12 SW32.1 52.73,11.12 58.98,11.12 SW32.2 59.13,11.12 62.79,11.12 SW33.1 | SW36.2 99.82,11.12 103.33,11.12 SW37.1 | SW34.2 79.55,11.12 83.06,11.12 SW35.1 | SW35.2 89.61,11.12 93.27,11.12 SW36.1 | SW39.2 130.3,11.12 133.81,11.12 SW40.1 | SW37.2 110.03,11.12 113.54,11.12 SW38.1 | SW38.2 120.09,11.12 123.75,11.12 SW39.1
  Bottom 0.152: SW33.2 69.19,11.12 62.94,11.12 SW33.1 | SW31.1 42.52,11.12 48.92,11.12 SW31.2 | SW35.1 83.21,11.12 89.46,11.12 SW35.2 | SW36.2 99.67,11.12 93.42,11.12 SW36.1 | SW40.2 140.36,11.12 133.96,11.12 SW40.1 | SW38.1 113.69,11.12 119.94,11.12 SW38.2 | SW39.2 130.15,11.12 123.9,11.12 SW39.1 | SW37.1 103.48,11.12 109.88,11.12 SW37.2 | SW34.1 73,11.12 79.4,11.12 SW34.2
RESETB
  Bottom 0.152: U3.24 35.05,74.83 35.05,74.07 16.31,55.32 16.31,44.35 15.24,43.28 U1.24
RX
  Top 0.152: U1.2 32,6.1 7.92,6.1 1.98,12.04 1.98,53.03 13.11,64.16 13.11,64.77 U3.8
SCL
  Bottom 0.152: U2.13 83.97,78.94 83.97,78.03 52.88,46.94 26.52,46.94 15.24,35.66 U1.27
SDA
  Bottom 0.152: U2.12 83.52,78.94 83.21,78.94 U2.11 83.06,78.94 83.06,78.03 52.27,47.24 24.38,47.24 U1.26
TX
  Bottom 0.152: U3.9 13.11,62.79 13.11,62.18 7.16,56.24 7.16,11.73 12.8,6.1 13.11,6.1 14.17,5.03 14.17,4.72 15.24,3.66 31.85,3.66 32.92,2.59 U1.1

### Text on the board
tPlace: LoRa Communicator BETA